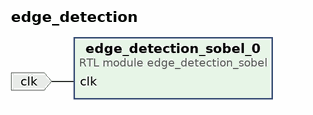
[diagram p0: block diagram of the top level]
# Vivado block design edge_detection, xc7z020clg400-1, Vivado 2020.1.1
create_bd_design edge_detection

create_bd_port -dir I -type clk clk
set_property -dict {CONFIG.FREQ_HZ 100000000} [get_bd_ports clk]

create_bd_cell -type module -reference edge_detection_sobel edge_detection_sobel_0

# ---- connections ----

connect_bd_net [get_bd_ports clk] [get_bd_pins edge_detection_sobel_0/clk]

validate_bd_design
save_bd_design
